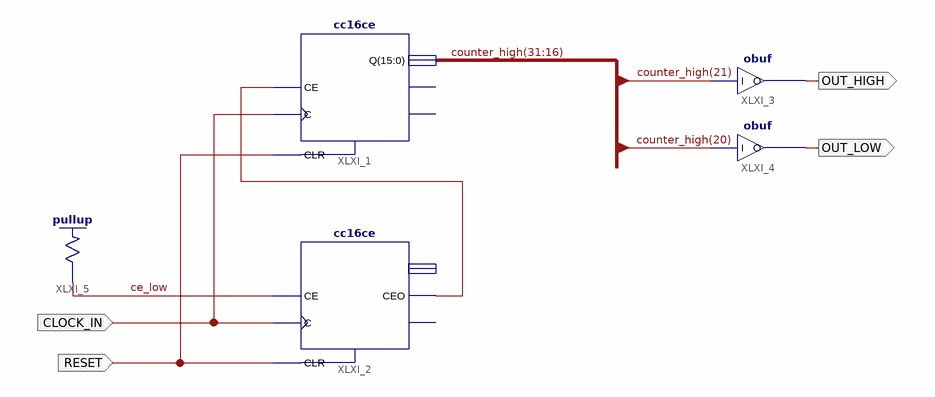
[diagram p0: schematic sheet 1]
// Xilinx ISE schematic BlinkSystem.sch (spartan6) as structural Verilog: 5 symbols, 4 ports
module BlinkSystem (
  input  CLOCK_IN,
  input  RESET,
  output OUT_HIGH,
  output OUT_LOW
);

  wire ce_low, XLXN_4;
  wire [31:16] counter_high;

  cc16ce XLXI_1 (.C(CLOCK_IN), .CE(XLXN_4), .CLR(RESET), .Q(counter_high));  // open: CEO, TC
  cc16ce XLXI_2 (.C(CLOCK_IN), .CE(ce_low), .CLR(RESET), .CEO(XLXN_4));  // open: Q, TC
  obuf XLXI_3 (.I(counter_high[21]), .O(OUT_HIGH));
  obuf XLXI_4 (.I(counter_high[20]), .O(OUT_LOW));
  \pullup  XLXI_5 (.O(ce_low));
endmodule
